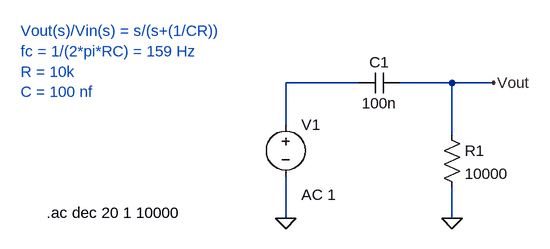
[diagram p0: schematic HighPass.asc]
HighPass.asc, the LTspice schematic file:
Version 4.1
SHEET 1 880 680
WIRE 240 -16 128 -16
WIRE 384 -16 304 -16
WIRE 448 -16 384 -16
WIRE 128 48 128 -16
WIRE 384 64 384 -16
WIRE 128 192 128 128
WIRE 384 192 384 144
FLAG 128 192 0
FLAG 384 192 0
FLAG 448 -16 Vout
SYMBOL cap 304 -32 R90
WINDOW 0 0 32 VBottom 2
WINDOW 3 32 32 VTop 2
SYMATTR InstName C1
SYMATTR Value 100n
SYMBOL res 368 48 R0
SYMATTR InstName R1
SYMATTR Value 10000
SYMBOL voltage 128 32 R0
WINDOW 123 24 124 Left 2
WINDOW 39 0 0 Left 0
SYMATTR InstName V1
SYMATTR Value ""
SYMATTR Value2 AC 1
TEXT -280 -96 Left 2 ;Vout(s)/Vin(s) = s/(s+(1/CR))\nfc = 1/(2*pi*RC) = 159 Hz\nR = 10k\nC = 100 nf
TEXT -240 184 Left 2 !.ac dec 20 1 10000

The netlist it stands for:
* HighPass.asc
C1 Vout N001 100n
R1 Vout 0 10000
V1 N001 0 AC 1
* Vout(s)/Vin(s) = s/(s+(1/CR))
* fc = 1/(2*pi*RC) = 159 Hz
* R = 10k
* C = 100 nf
.ac dec 20 1 10000
.backanno
.end